# Altium schematic sheet rs485.SchDoc
size A4
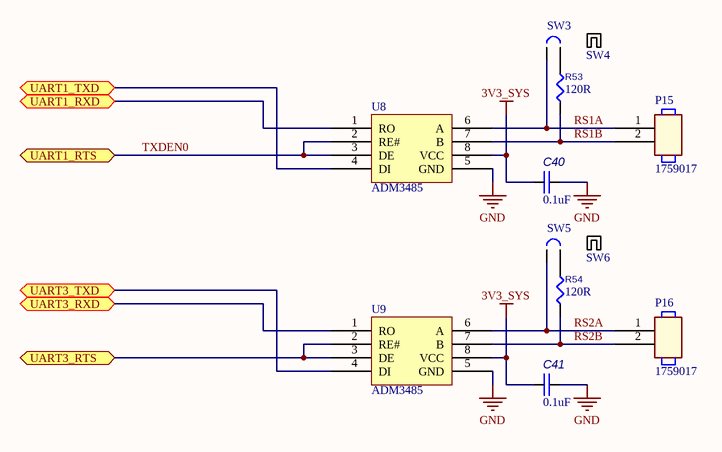
[diagram p0: rs485.SchDoc]

## Parts
C40  value 0.1uF  [CC1608-0603]  (hidden comment: C0603)
C41  value 0.1uF  [CC1608-0603]  (hidden comment: C0603)
P15  P/N2: 1759017  [TE_282814-2]  (hidden comment: TE_282814-2)
P16  P/N2: 1759017  [TE_282814-2]  (hidden comment: TE_282814-2)
R53  value 120R  [RESC1608X55N]  (hidden comment: R0603)
R54  value 120R  [RESC1608X55N]  (hidden comment: R0603)
SW3  Jumper 2-pin  [JUMPER_2]  (value not drawn)
SW4  Jumper  (value not drawn)
SW5  Jumper 2-pin  [JUMPER_2]  (value not drawn)
SW6  Jumper  (value not drawn)
U8  ADM3485  [SOIC127P600X175-8N]
U9  ADM3485  [SOIC127P600X175-8N]

## Ports
UART1_RTS, UART1_RXD, UART1_TXD, UART3_RTS, UART3_RXD, UART3_TXD

## Nets
3V3_SYS: C40.1 C41.1 U8.8(VCC) U9.8(VCC)
GND: C40.2 C41.2 U8.5(GND) U9.5(GND)
RS1A: P15.1 SW3.1 U8.6(A)
RS1B: P15.2 R53.1 U8.7(B)
RS2A: P16.1 SW5.1 U9.6(A)
RS2B: P16.2 R54.1 U9.7(B)
TXDEN0: U8.2(RE#) U8.3(DE) ; port UART1_RTS
UART1_RXD: U8.1(RO) ; port UART1_RXD
UART1_TXD: U8.4(DI) ; port UART1_TXD
UART3_RTS: U9.2(RE#) U9.3(DE) ; port UART3_RTS
UART3_RXD: U9.1(RO) ; port UART3_RXD
UART3_TXD: U9.4(DI) ; port UART3_TXD
NetR53_2: R53.2 SW3.2
NetR54_2: R54.2 SW5.2

Not connected (* = marked no-connect by the designer): SW4 1 2; SW6 1 2

## Library data of the parts
P15 P16 = TE_282814-2: Terminal Block Connectors; Manufacturer: TE Connectivity; P/N: 282814-2
SW3 SW5 = Jumper 2-pin: Jumper 2-pin 2.54mm; P/N: PLS-2
SW4 SW6 = Jumper: Jumper 2.54mm; P/N: MJ-0
U8 U9 = ADM3485: RS-485 Half-Duplex transceiver; P/N2: ADM3485ARZ; P/N: SN65HVD1780DR
C40 C41 = C0603: P/N: *
R53 R54 = R0603: P/N: *